# Altium schematic sheet OBC_Local-Supply.SchDoc: Local Supply
size A4
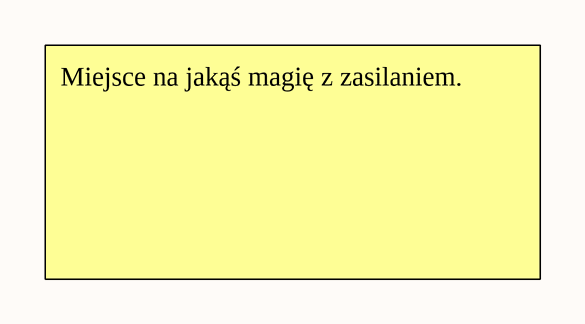
[diagram p0: OBC_Local-Supply.SchDoc]

## Notes on the sheet
- Miejsce na jakąś magię z zasilaniem.
- Title:
- Project:
- Author:
- Model:
- Document Number:
- Checked by:
- Rev:
- Date:
- Approved by:
- Sheet:
- of
- File name: